# EAGLE design PBCtest (EAGLE 9.4.2)
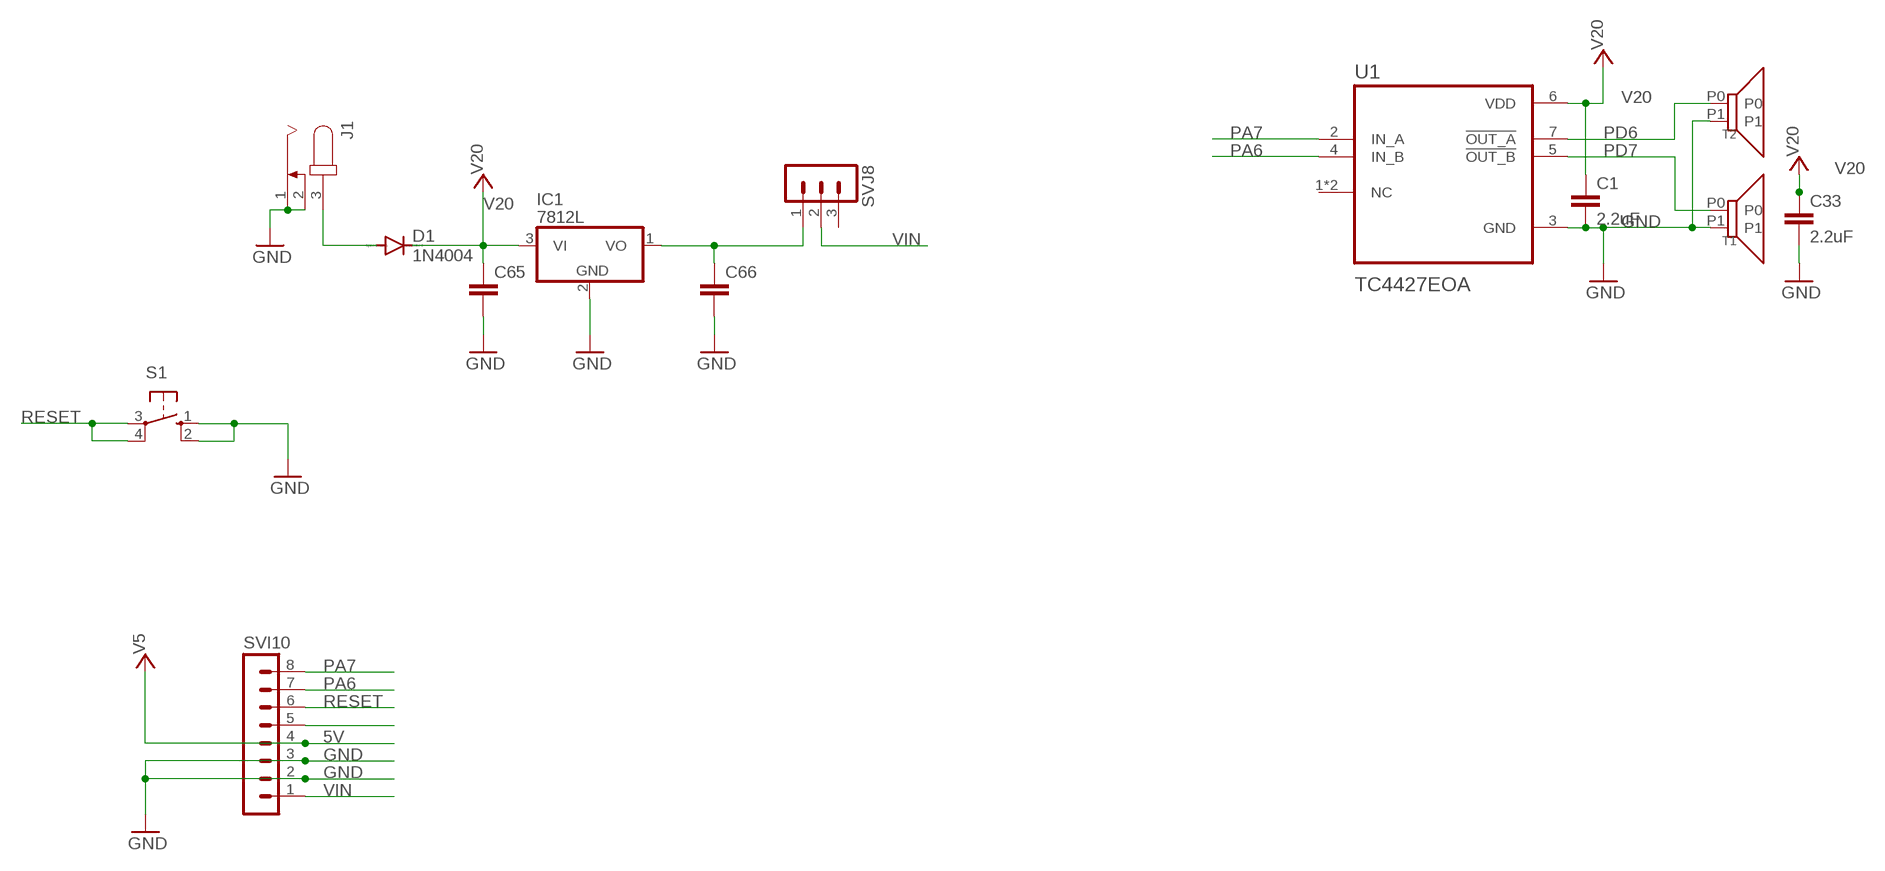
[diagram p0: schematic, sheet 1]

## Parts
C1  2.2uF  C-EUC1206  [C1206]
C33  2.2uF  C-EUC1206  [C1206]
C65  C-EU050-025X075  [C050-025X075]
C66  C-EU050-025X075  [C050-025X075]
D1  1N4004  [DO41-10]
IC1  7812L  [TO92]
J1  JACK-PLUG0  [SPC4077]
S1  10-XX  [B3F-10XX]
SVI10  MA08-1  [MA08-1]
SVJ8  MA03-1  [MA03-1]
T1  TCT40-16  [TCT40-16]
T2  TCT40-16  [TCT40-16]
U1  TC4427EOA  [SOIC127P599X175-8N]

## Nets
5V: SVI10.4 ; supply symbol labelled V5
GND: C1.2 C33.2 C65.2 C66.2 IC1.2(GND) J1.1 J1.2 S1.1(S) S1.2(S1) SVI10.2 SVI10.3 T1.P1 T2.P1 U1.3(GND)
N$1 [PWR]: D1.A J1.3
N$2: SVI10.5
N$4: C66.1 IC1.1(VO) SVJ8.1
PA6: SVI10.7 U1.4(IN_B)
PA7: SVI10.8 U1.2(IN_A)
PD6 [DRV]: T2.P0 U1.7(!OUT_A)
PD7 [DRV]: T1.P0 U1.5(!OUT_B)
RESET: S1.3(P) S1.4(P1) SVI10.6
V20 [PWR]: C1.1 C33.1 C65.1 D1.C IC1.3(VI) U1.6(VDD)
VIN: SVI10.1 SVJ8.2
Unconnected: SVJ8.3 U1.1(NC) U1.8(NC)

## Library data of the parts
C1 C33 C65 C66 = rcl:C-EU: CAPACITOR, European symbol; SPICEPREFIX: C
D1 = diode:1N4004: DIODE general purpose rectifier, 1 A
IC1 = linear:78*: Positive VOLTAGE REGULATOR Source: http://cache.national.com/ds/LM/LM78L05.pdf http://www.fairchildsemi.com/ds/LM/LM7805.pdf
J1 = con-jack:JACK-PLUG: DC POWER JACK Power Jack, DC, Right Angle, Through Hole, Rated 5A at 16VDC, PC Terminals Distributor: Farnell (www.Farnell.de) Drawing: 84N1161.pdf / 84N1162.pdf Manufacturer: SPC Technology (www.spctechnology.com) Type: SPC4077 / SPC 4078; OC_FARNELL: unknown; OC_NEWARK: unknown
S1 = switch-omron:10-XX: OMRON SWITCH; MPN: B3F-1000; OC_FARNELL: 176432; OC_NEWARK: 36M3542
SVI10 = con-lstb:MA08-1: PIN HEADER; OC_FARNELL: unknown; OC_NEWARK: unknown
SVJ8 = con-lstb:MA03-1: PIN HEADER; OC_FARNELL: unknown; OC_NEWARK: unknown
T1 T2 = ultrasonic:TCT40-16: TCT40-16 T/R Ultrasonic transducer. 40kHz. Diameter: 16mm
U1 = TC4427EOA:TC4427EOA; AVAILABILITY: Unavailable; DESCRIPTION: Low-Side Gate Driver IC Non-Inverting 8-SOIC; MF: Microchip; MP: TC4427EOA; PACKAGE: SOIC-8 Microchip; PRICE: None

## Net classes
0 default: width 0.508 mm, drill 0.254 mm, clearance 0.205 mm
1 PWR: width 1.27 mm, drill 0.762 mm
2 DRV: width 1.27 mm, drill 0.508 mm

## Board
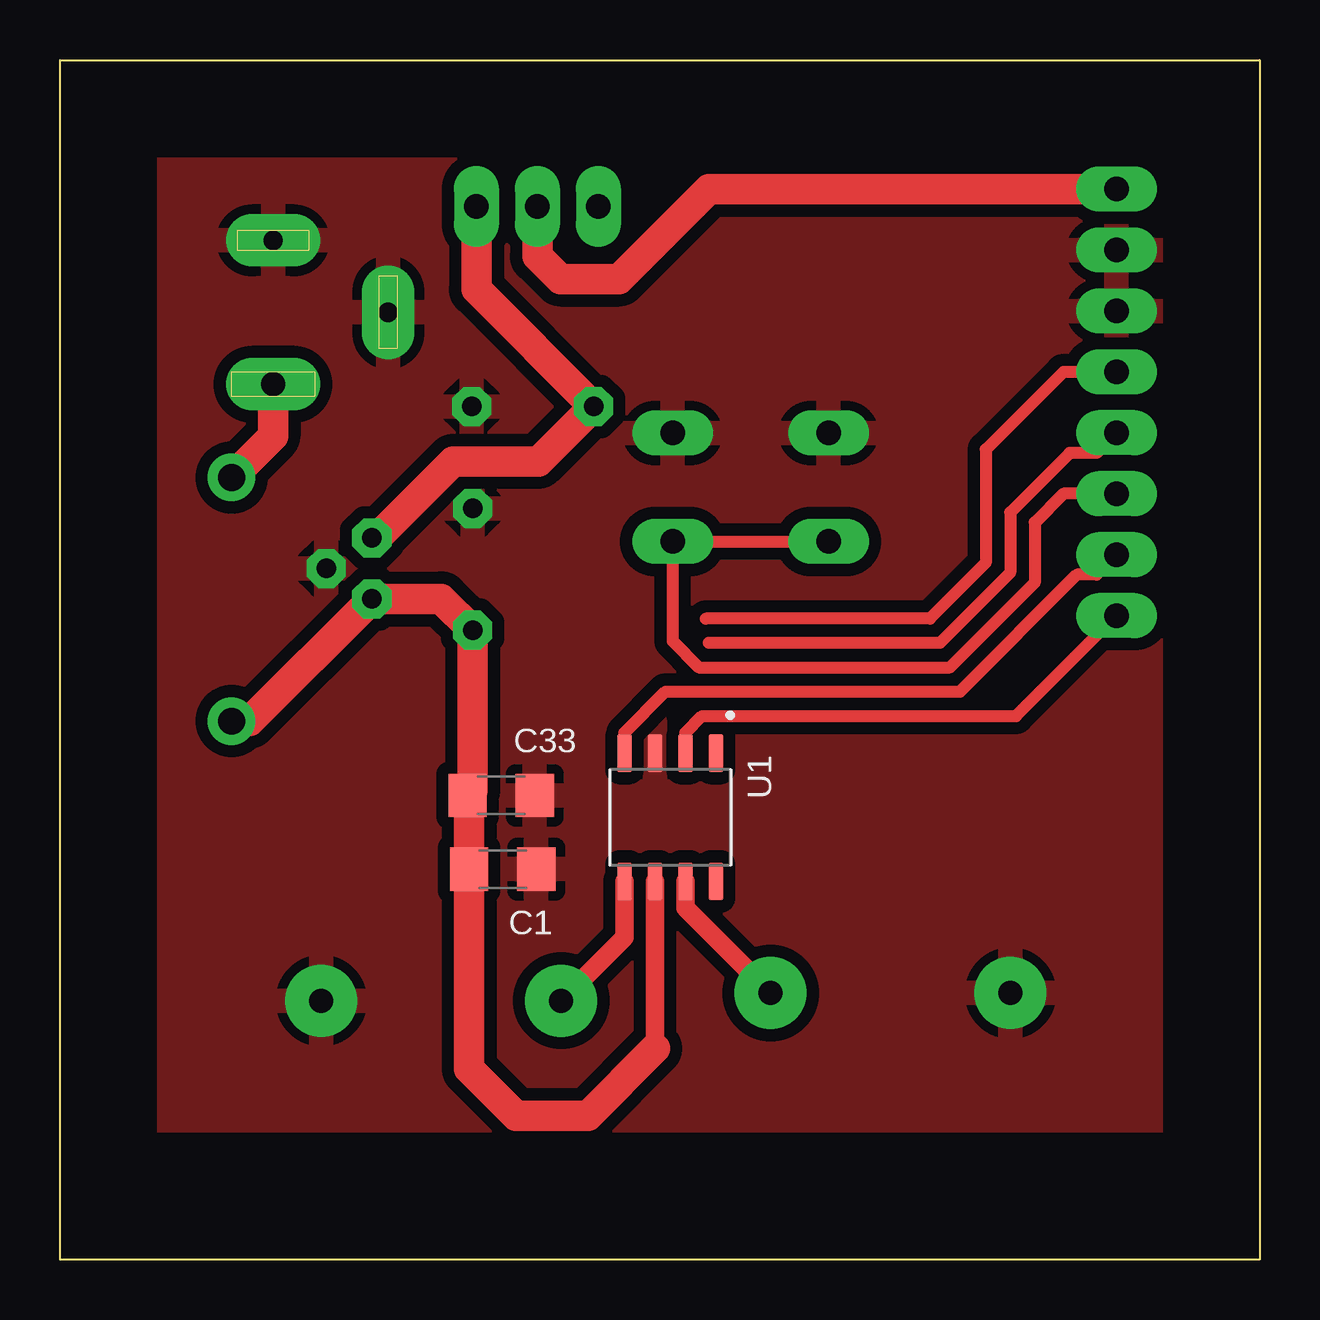
[diagram p1: board, top side]
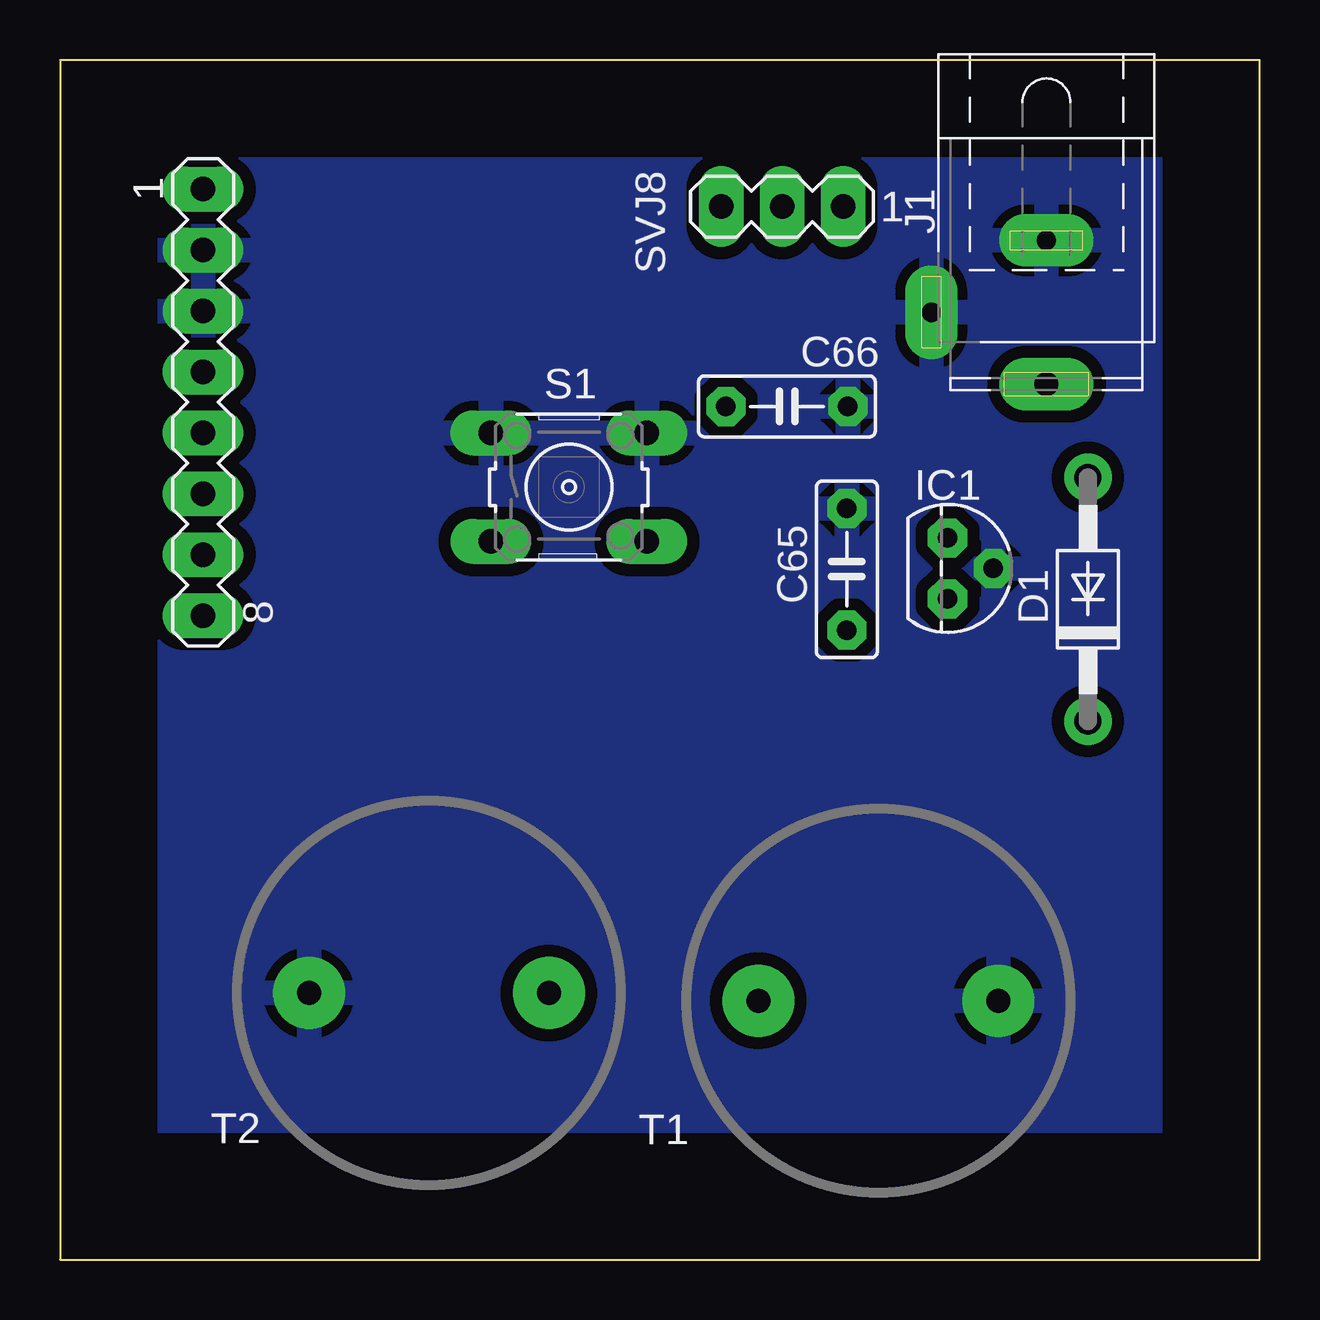
[diagram p2: board, bottom side, seen from below]

Size 50 x 50 mm. Coordinates in mm from the lower left corner, seen from the top.
Outline: 0,0 0,50 50,50 50,0 0,0
Copper layers (1*16): Top 0.035mm / dielectric 1.5mm / Bottom 0.035mm
Design rules "PBCtest *": minimum track width 18mil, minimum drill 0.1mm, track to track 20mil, track to pad 20mil, pad to pad 20mil, via to via 20mil, smd to smd 20mil, copper to edge 4mm, drill to drill 1mm, minimum pad ring 10mil, minimum via ring 10mil, stop-mask expansion 3mil, vias tented up to drill 0mil, thermal gap 16mil

### Footprints (pad centres in the part's own frame; a part is rotated, then mirrored left to right if it is on the bottom)
C1206 = smd 1.6 x 1.8: 1 -1.4,0; 2 1.4,0
C050-025X075 = drill 0.813 octagon: 1 -2.54,0; 2 2.54,0
DO41-10 = drill 1.118: A 5.08,0; C -5.08,0
TO92 = drill 0.813 octagon: 1 -1.27,0; 2 0,1.905; 3 1.27,0
SPC4077 = drill 0.8 pad 2.184 long: 1 -3,0; 2 0,-4.8 | drill 1 pad 2.184 long: 3 3,0
B3F-10XX = drill 1.016 long: 1 -3.251,2.261; 2 3.251,2.261; 3 -3.251,-2.261; 4 3.251,-2.261
MA08-1 = drill 1.016 long: 1 -8.89,0; 2 -6.35,0; 3 -3.81,0; 4 -1.27,0; 5 1.27,0; 6 3.81,0; 7 6.35,0; 8 8.89,0
MA03-1 = drill 1.016 long: 1 -2.54,0; 2 0,0; 3 2.54,0
TCT40-16 = drill 1 pad 3: P0 -5,0; P1 5,0
SOIC127P599X175-8N = smd 1.58 x 0.6: 1 -2.67,1.905; 2 -2.67,0.635; 3 -2.67,-0.635; 4 -2.67,-1.905; 5 2.67,-1.905; 6 2.67,-0.635; 7 2.67,0.635; 8 2.67,1.905

### Placement (x,y rotation side)
C1  18.45,16.27 0 top
C33  18.39,19.35 0 top
C65  17.2,28.77 90 bottom
C66  19.7,35.56 0 bottom
D1  7.15,27.52 90 bottom
IC1  13,28.81 270 bottom
J1  8.88,39.48 270 bottom
S1  28.79,32.19 0 bottom
SVI10  44.04,35.73 270 bottom
SVJ8  19.9,43.89 180 bottom
T1  15.89,10.79 0 bottom
T2  34.62,11.11 180 bottom
U1  25.43,18.43 270 top

### Tracks (layer width: path | path; a pad name or v marks a point on that pad's centre or on a via)
5V
  Top 0.508: SVI10.4 41.83,37 38.59,33.77 38.59,29.05 36.26,26.72 26.92,26.72
GND
  pour Top: 0,5.84 0,50 50,50 50,5.84
  pour Bottom: 0,5.84 0,50 50,50 50,5.84
  pour Top: 0,5.33 0,50 50,50 50,5.33
  pour Bottom: 0,5.33 0,50 50,50 50,5.33
N$1
  Top 1.27: J1.3 8.88,34.33 D1.A
N$2
  Top 0.508: SVI10.5 43.2,33.62 42.09,33.62 39.61,31.14 39.61,28.63 36.68,25.7 27.04,25.7
N$4
  Top 1.27: IC1.1 13.2,30.08 16.39,33.27 19.95,33.27 C66.1 17.36,40.44 SVJ8.1
PA6
  Top 0.508: SVI10.7 43.2,28.54 42.4,28.54 37.52,23.67 25.24,23.67 23.53,21.96 U1.4
PA7
  Top 0.508: SVI10.8 39.85,22.65 27.94,22.65 26.77,22.65 26.07,21.96 U1.2
PD6
  Top 0.762: U1.7 26.07,14.66 T2.P0
PD7
  Top 0.762: U1.5 23.53,13.43 T1.P0
RESET
  Top 0.508: SVI10.6 41.83,31.92 40.62,30.72 40.62,28.21 37.1,24.69 26.62,24.69 25.54,25.77 S1.4 S1.3
V20
  Top 0.762: U1.6 24.8,8.8
  Top 1.27: 24.8,8.8 22,6 19,6 17.05,7.95 C1.1 17.05,19.29 C33.1 17.2,19.56 C65.1 15.89,27.54 IC1.3 7.9,22.44 D1.C
VIN
  Top 1.27: SVI10.1 27.05,44.62 23.3,40.87 20.86,40.87 19.9,41.82 SVJ8.2

### Text on the board
bName: bottom | PCBtest v1.1
tName: top | PCBtest v1.1
bDesc: VIN | GND | ON | OFF | GND | VIN_EN | 5V | 3V3 | RESET | 18VDC | T1 | T2 | (2,1) | 29 | (1,1) | 27